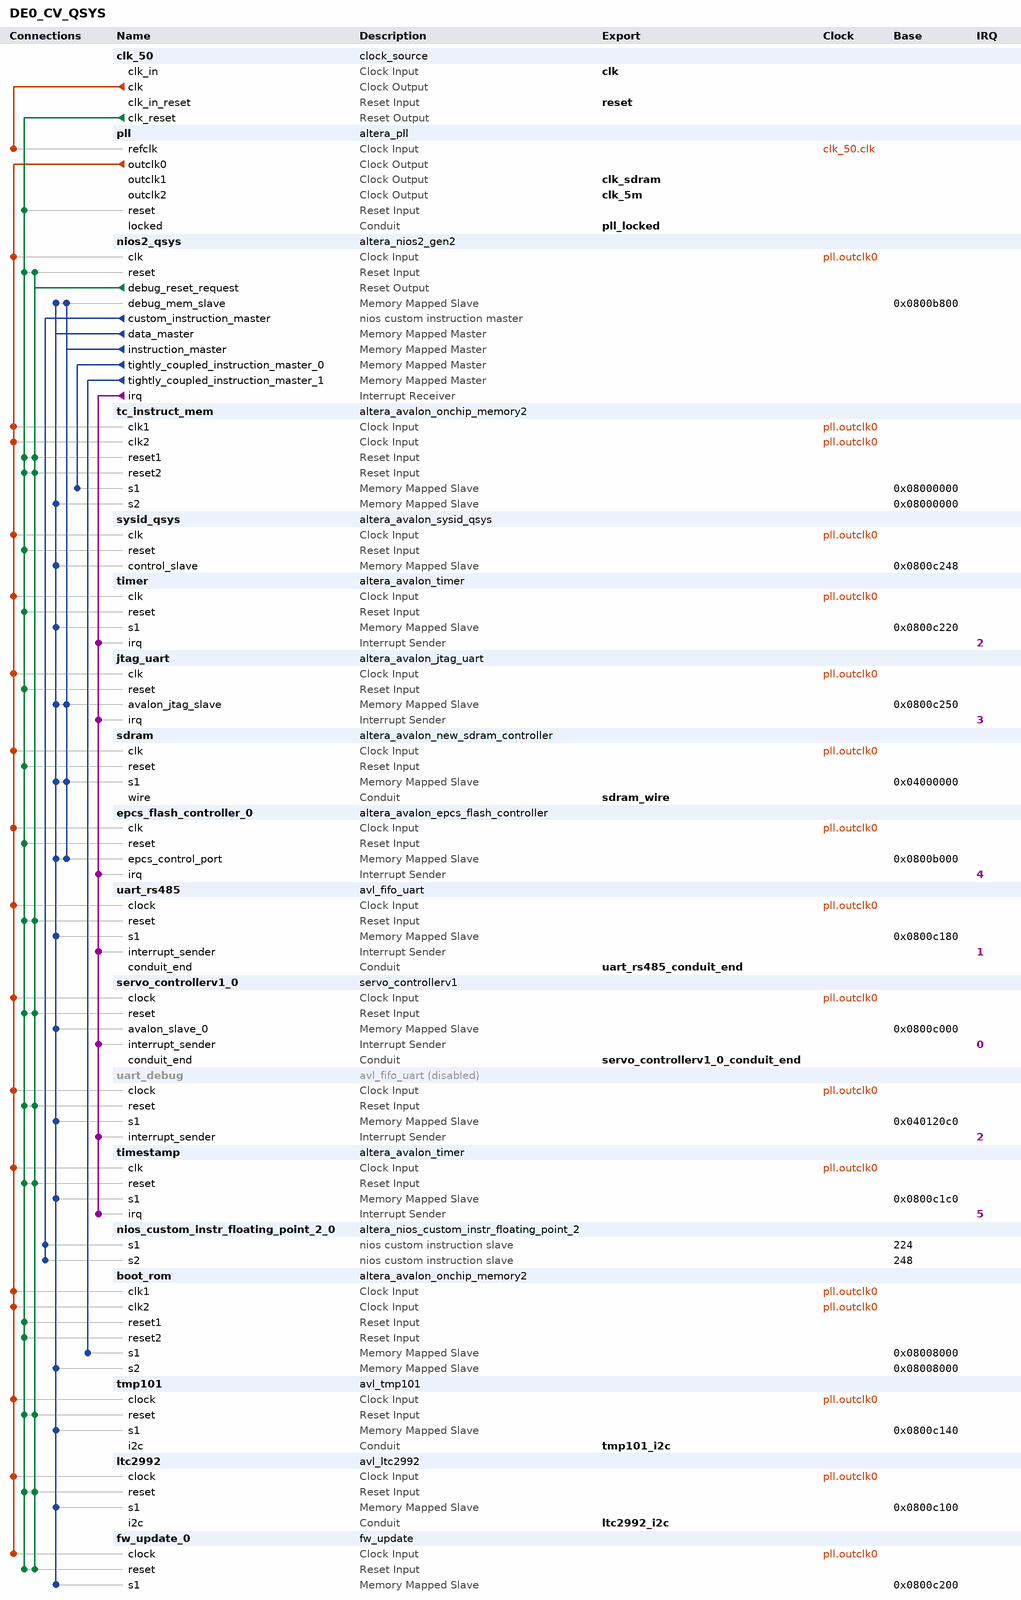
[diagram p0: system contents]
# Platform Designer (Qsys) system DE0_CV_QSYS, Cyclone V 5CEBA4F23C7
# Parameters at their usual value, and those the tool derives, are not listed.
package require -exact qsys 18.1
create_system DE0_CV_QSYS
set_project_property DEVICE_FAMILY {Cyclone V}
set_project_property DEVICE 5CEBA4F23C7

add_instance clk_50 clock_source 18.1
set_instance_parameter_value clk_50 clockFrequency 50000000

add_instance pll altera_pll 18.1
set_instance_parameter_value pll gui_device_speed_grade 2
set_instance_parameter_value pll gui_number_of_clocks 3
set_instance_parameter_value pll gui_operation_mode normal
set_instance_parameter_value pll gui_output_clock_frequency0 100.0
set_instance_parameter_value pll gui_output_clock_frequency1 100.0
set_instance_parameter_value pll gui_output_clock_frequency2 5.0
set_instance_parameter_value pll gui_phase_shift1 -3800
set_instance_parameter_value pll gui_phase_shift_deg1 -90.0
set_instance_parameter_value pll gui_pll_mode {Integer-N PLL}
set_instance_parameter_value pll gui_reference_clock_frequency 50.0
set_instance_parameter_value pll gui_use_locked true

add_instance nios2_qsys altera_nios2_gen2 18.1
set_instance_parameter_value nios2_qsys dcache_size 65536
set_instance_parameter_value nios2_qsys dividerType srt2
set_instance_parameter_value nios2_qsys exceptionSlave tc_instruct_mem.s1
set_instance_parameter_value nios2_qsys icache_numTCIM 2
set_instance_parameter_value nios2_qsys icache_size 65536
set_instance_parameter_value nios2_qsys impl Fast
set_instance_parameter_value nios2_qsys resetSlave boot_rom.s1
set_instance_parameter_value nios2_qsys setting_activateTrace true

add_instance tc_instruct_mem altera_avalon_onchip_memory2 18.1
set_instance_parameter_value tc_instruct_mem dataWidth 32
set_instance_parameter_value tc_instruct_mem dualPort true
set_instance_parameter_value tc_instruct_mem initMemContent true
set_instance_parameter_value tc_instruct_mem initializationFileName onchip_mem.hex
set_instance_parameter_value tc_instruct_mem memorySize 16536

add_instance sysid_qsys altera_avalon_sysid_qsys 18.1
set_instance_parameter_value sysid_qsys id 0

add_instance timer altera_avalon_timer 18.1
set_instance_parameter_value timer period 1
set_instance_parameter_value timer periodUnits MSEC

add_instance jtag_uart altera_avalon_jtag_uart 18.1
set_instance_parameter_value jtag_uart simInteractiveOptions NO_INTERACTIVE_WINDOWS

add_instance sdram altera_avalon_new_sdram_controller 18.1
set_instance_parameter_value sdram TAC 5.4
set_instance_parameter_value sdram TRCD 15.0
set_instance_parameter_value sdram TRP 15.0
set_instance_parameter_value sdram casLatency 3
set_instance_parameter_value sdram columnWidth 10
set_instance_parameter_value sdram dataWidth 16
set_instance_parameter_value sdram generateSimulationModel true
set_instance_parameter_value sdram model single_Micron_MT48LC4M32B2_7_chip
set_instance_parameter_value sdram numberOfBanks 4
set_instance_parameter_value sdram numberOfChipSelects 1
set_instance_parameter_value sdram powerUpDelay 100.0
set_instance_parameter_value sdram refreshPeriod 7.8125
set_instance_parameter_value sdram rowWidth 13

add_instance epcs_flash_controller_0 altera_avalon_epcs_flash_controller 18.1
set_instance_parameter_value epcs_flash_controller_0 resetrequest_enabled true

add_instance uart_rs485 avl_fifo_uart 1.0
set_instance_parameter_value uart_rs485 BAUDRATE 921600
set_instance_parameter_value uart_rs485 C_RX_THRESHOLD 32
set_instance_parameter_value uart_rs485 DATA_BIT 8
set_instance_parameter_value uart_rs485 FREQ_CLK 100000000
set_instance_parameter_value uart_rs485 OVERSAMPLING_RATE 4
set_instance_parameter_value uart_rs485 PARITY_BIT 0
set_instance_parameter_value uart_rs485 RX_FIFO_DEPTH 7
set_instance_parameter_value uart_rs485 RX_TIMEOUT_WORD 4
set_instance_parameter_value uart_rs485 STOP_BIT 0
set_instance_parameter_value uart_rs485 TX_FIFO_DEPTH 12

add_instance servo_controllerv1_0 servo_controllerv1 1.0
set_instance_parameter_value servo_controllerv1_0 C_MODE0 0
set_instance_parameter_value servo_controllerv1_0 C_MODE1 0
set_instance_parameter_value servo_controllerv1_0 C_MODE2 0
set_instance_parameter_value servo_controllerv1_0 C_MODE3 0
set_instance_parameter_value servo_controllerv1_0 FREQ_CLK 100000000
set_instance_parameter_value servo_controllerv1_0 PWM_BASE_FREQ 10000000
set_instance_parameter_value servo_controllerv1_0 PWM_FREQ 1000
set_instance_parameter_value servo_controllerv1_0 SPI_SPEED 1000000

add_instance uart_debug avl_fifo_uart 1.0
set_instance_property uart_debug ENABLED false
set_instance_parameter_value uart_debug BAUDRATE 921600
set_instance_parameter_value uart_debug C_RX_THRESHOLD 32
set_instance_parameter_value uart_debug DATA_BIT 8
set_instance_parameter_value uart_debug FREQ_CLK 100000000
set_instance_parameter_value uart_debug OVERSAMPLING_RATE 4
set_instance_parameter_value uart_debug PARITY_BIT 0
set_instance_parameter_value uart_debug RX_FIFO_DEPTH 4
set_instance_parameter_value uart_debug RX_TIMEOUT_WORD 4
set_instance_parameter_value uart_debug STOP_BIT 0
set_instance_parameter_value uart_debug TX_FIFO_DEPTH 11

add_instance timestamp altera_avalon_timer 18.1
set_instance_parameter_value timestamp counterSize 64
set_instance_parameter_value timestamp period 1000
set_instance_parameter_value timestamp periodUnits CLOCKS

add_instance nios_custom_instr_floating_point_2_0 altera_nios_custom_instr_floating_point_2 18.1
set_instance_parameter_value nios_custom_instr_floating_point_2_0 arithmetic_present true
set_instance_parameter_value nios_custom_instr_floating_point_2_0 comparison_present true
set_instance_parameter_value nios_custom_instr_floating_point_2_0 conversion_present true
set_instance_parameter_value nios_custom_instr_floating_point_2_0 root_present true

add_instance boot_rom altera_avalon_onchip_memory2 18.1
set_instance_parameter_value boot_rom dataWidth 32
set_instance_parameter_value boot_rom dualPort true
set_instance_parameter_value boot_rom initMemContent true
set_instance_parameter_value boot_rom initializationFileName onchip_mem.hex
set_instance_parameter_value boot_rom memorySize 8192

add_instance tmp101 avl_tmp101 1.0
set_instance_parameter_value tmp101 BUS_CLK 100000
set_instance_parameter_value tmp101 FREQ_CLK 100000000
set_instance_parameter_value tmp101 I2C_ADDR 0
set_instance_parameter_value tmp101 UPDATE_FREQ 2

add_instance ltc2992 avl_ltc2992 1.0
set_instance_parameter_value ltc2992 BUS_CLK 10000
set_instance_parameter_value ltc2992 FREQ_CLK 100000000

add_instance fw_update_0 fw_update 1.0
set_instance_parameter_value fw_update_0 LOCK_PWD 1234532
set_instance_parameter_value fw_update_0 PRODUCT_ID 0
set_instance_parameter_value fw_update_0 VERSION_MAJOR 1
set_instance_parameter_value fw_update_0 VERSION_MINOR 4

# connections
add_connection clk_50.clk pll.refclk clock
add_connection pll.outclk0 boot_rom.clk1 clock
add_connection pll.outclk0 boot_rom.clk2 clock
add_connection pll.outclk0 epcs_flash_controller_0.clk clock
add_connection pll.outclk0 fw_update_0.clock clock
add_connection pll.outclk0 jtag_uart.clk clock
add_connection pll.outclk0 ltc2992.clock clock
add_connection pll.outclk0 nios2_qsys.clk clock
add_connection pll.outclk0 sdram.clk clock
add_connection pll.outclk0 servo_controllerv1_0.clock clock
add_connection pll.outclk0 sysid_qsys.clk clock
add_connection pll.outclk0 tc_instruct_mem.clk1 clock
add_connection pll.outclk0 tc_instruct_mem.clk2 clock
add_connection pll.outclk0 timer.clk clock
add_connection pll.outclk0 timestamp.clk clock
add_connection pll.outclk0 tmp101.clock clock
add_connection pll.outclk0 uart_debug.clock clock
add_connection pll.outclk0 uart_rs485.clock clock
add_connection clk_50.clk_reset boot_rom.reset1 reset
add_connection clk_50.clk_reset boot_rom.reset2 reset
add_connection clk_50.clk_reset epcs_flash_controller_0.reset reset
add_connection clk_50.clk_reset fw_update_0.reset reset
add_connection clk_50.clk_reset jtag_uart.reset reset
add_connection clk_50.clk_reset ltc2992.reset reset
add_connection clk_50.clk_reset nios2_qsys.reset reset
add_connection clk_50.clk_reset pll.reset reset
add_connection clk_50.clk_reset sdram.reset reset
add_connection clk_50.clk_reset servo_controllerv1_0.reset reset
add_connection clk_50.clk_reset sysid_qsys.reset reset
add_connection clk_50.clk_reset tc_instruct_mem.reset1 reset
add_connection clk_50.clk_reset tc_instruct_mem.reset2 reset
add_connection clk_50.clk_reset timer.reset reset
add_connection clk_50.clk_reset timestamp.reset reset
add_connection clk_50.clk_reset tmp101.reset reset
add_connection clk_50.clk_reset uart_debug.reset reset
add_connection clk_50.clk_reset uart_rs485.reset reset
add_connection nios2_qsys.debug_reset_request fw_update_0.reset reset
add_connection nios2_qsys.debug_reset_request ltc2992.reset reset
add_connection nios2_qsys.debug_reset_request nios2_qsys.reset reset
add_connection nios2_qsys.debug_reset_request servo_controllerv1_0.reset reset
add_connection nios2_qsys.debug_reset_request tc_instruct_mem.reset1 reset
add_connection nios2_qsys.debug_reset_request tc_instruct_mem.reset2 reset
add_connection nios2_qsys.debug_reset_request timestamp.reset reset
add_connection nios2_qsys.debug_reset_request tmp101.reset reset
add_connection nios2_qsys.debug_reset_request uart_debug.reset reset
add_connection nios2_qsys.debug_reset_request uart_rs485.reset reset
add_connection nios2_qsys.data_master boot_rom.s2 avalon
set_connection_parameter_value nios2_qsys.data_master/boot_rom.s2 baseAddress 0x08008000
add_connection nios2_qsys.data_master epcs_flash_controller_0.epcs_control_port avalon
set_connection_parameter_value nios2_qsys.data_master/epcs_flash_controller_0.epcs_control_port baseAddress 0x0800b000
add_connection nios2_qsys.data_master fw_update_0.s1 avalon
set_connection_parameter_value nios2_qsys.data_master/fw_update_0.s1 baseAddress 0x0800c200
add_connection nios2_qsys.data_master jtag_uart.avalon_jtag_slave avalon
set_connection_parameter_value nios2_qsys.data_master/jtag_uart.avalon_jtag_slave baseAddress 0x0800c250
add_connection nios2_qsys.data_master ltc2992.s1 avalon
set_connection_parameter_value nios2_qsys.data_master/ltc2992.s1 baseAddress 0x0800c100
add_connection nios2_qsys.data_master nios2_qsys.debug_mem_slave avalon
set_connection_parameter_value nios2_qsys.data_master/nios2_qsys.debug_mem_slave baseAddress 0x0800b800
add_connection nios2_qsys.data_master sdram.s1 avalon
set_connection_parameter_value nios2_qsys.data_master/sdram.s1 baseAddress 0x04000000
add_connection nios2_qsys.data_master servo_controllerv1_0.avalon_slave_0 avalon
set_connection_parameter_value nios2_qsys.data_master/servo_controllerv1_0.avalon_slave_0 baseAddress 0x0800c000
add_connection nios2_qsys.data_master sysid_qsys.control_slave avalon
set_connection_parameter_value nios2_qsys.data_master/sysid_qsys.control_slave baseAddress 0x0800c248
add_connection nios2_qsys.data_master tc_instruct_mem.s2 avalon
set_connection_parameter_value nios2_qsys.data_master/tc_instruct_mem.s2 baseAddress 0x08000000
add_connection nios2_qsys.data_master timer.s1 avalon
set_connection_parameter_value nios2_qsys.data_master/timer.s1 baseAddress 0x0800c220
add_connection nios2_qsys.data_master timestamp.s1 avalon
set_connection_parameter_value nios2_qsys.data_master/timestamp.s1 baseAddress 0x0800c1c0
add_connection nios2_qsys.data_master tmp101.s1 avalon
set_connection_parameter_value nios2_qsys.data_master/tmp101.s1 baseAddress 0x0800c140
add_connection nios2_qsys.data_master uart_debug.s1 avalon
set_connection_parameter_value nios2_qsys.data_master/uart_debug.s1 baseAddress 0x040120c0
add_connection nios2_qsys.data_master uart_rs485.s1 avalon
set_connection_parameter_value nios2_qsys.data_master/uart_rs485.s1 baseAddress 0x0800c180
add_connection nios2_qsys.instruction_master epcs_flash_controller_0.epcs_control_port avalon
set_connection_parameter_value nios2_qsys.instruction_master/epcs_flash_controller_0.epcs_control_port baseAddress 0x0800b000
add_connection nios2_qsys.instruction_master jtag_uart.avalon_jtag_slave avalon
set_connection_parameter_value nios2_qsys.instruction_master/jtag_uart.avalon_jtag_slave baseAddress 0x0800c250
add_connection nios2_qsys.instruction_master nios2_qsys.debug_mem_slave avalon
set_connection_parameter_value nios2_qsys.instruction_master/nios2_qsys.debug_mem_slave baseAddress 0x0800b800
add_connection nios2_qsys.instruction_master sdram.s1 avalon
set_connection_parameter_value nios2_qsys.instruction_master/sdram.s1 baseAddress 0x04000000
add_connection nios2_qsys.tightly_coupled_instruction_master_0 tc_instruct_mem.s1 avalon
set_connection_parameter_value nios2_qsys.tightly_coupled_instruction_master_0/tc_instruct_mem.s1 baseAddress 0x08000000
add_connection nios2_qsys.tightly_coupled_instruction_master_1 boot_rom.s1 avalon
set_connection_parameter_value nios2_qsys.tightly_coupled_instruction_master_1/boot_rom.s1 baseAddress 0x08008000
add_connection nios2_qsys.irq epcs_flash_controller_0.irq interrupt
set_connection_parameter_value nios2_qsys.irq/epcs_flash_controller_0.irq irqNumber 4
add_connection nios2_qsys.irq jtag_uart.irq interrupt
set_connection_parameter_value nios2_qsys.irq/jtag_uart.irq irqNumber 3
add_connection nios2_qsys.irq servo_controllerv1_0.interrupt_sender interrupt
set_connection_parameter_value nios2_qsys.irq/servo_controllerv1_0.interrupt_sender irqNumber 0
add_connection nios2_qsys.irq timer.irq interrupt
set_connection_parameter_value nios2_qsys.irq/timer.irq irqNumber 2
add_connection nios2_qsys.irq timestamp.irq interrupt
set_connection_parameter_value nios2_qsys.irq/timestamp.irq irqNumber 5
add_connection nios2_qsys.irq uart_debug.interrupt_sender interrupt
set_connection_parameter_value nios2_qsys.irq/uart_debug.interrupt_sender irqNumber 2
add_connection nios2_qsys.irq uart_rs485.interrupt_sender interrupt
set_connection_parameter_value nios2_qsys.irq/uart_rs485.interrupt_sender irqNumber 1
add_connection nios2_qsys.custom_instruction_master nios_custom_instr_floating_point_2_0.s1 nios_custom_instruction
set_connection_parameter_value nios2_qsys.custom_instruction_master/nios_custom_instr_floating_point_2_0.s1 CIName nios_custom_instr_floating_point_2_0
set_connection_parameter_value nios2_qsys.custom_instruction_master/nios_custom_instr_floating_point_2_0.s1 baseAddress 224
add_connection nios2_qsys.custom_instruction_master nios_custom_instr_floating_point_2_0.s2 nios_custom_instruction
set_connection_parameter_value nios2_qsys.custom_instruction_master/nios_custom_instr_floating_point_2_0.s2 CIName nios_custom_instr_floating_point_2_0_1
set_connection_parameter_value nios2_qsys.custom_instruction_master/nios_custom_instr_floating_point_2_0.s2 baseAddress 248

# exported interfaces
add_interface clk clock sink
set_interface_property clk EXPORT_OF clk_50.clk_in
add_interface clk_5m clock source
set_interface_property clk_5m EXPORT_OF pll.outclk2
add_interface clk_sdram clock source
set_interface_property clk_sdram EXPORT_OF pll.outclk1
add_interface ltc2992_i2c conduit end
set_interface_property ltc2992_i2c EXPORT_OF ltc2992.i2c
add_interface pll_locked conduit end
set_interface_property pll_locked EXPORT_OF pll.locked
add_interface reset reset sink
set_interface_property reset EXPORT_OF clk_50.clk_in_reset
add_interface sdram_wire conduit end
set_interface_property sdram_wire EXPORT_OF sdram.wire
add_interface servo_controllerv1_0_conduit_end conduit end
set_interface_property servo_controllerv1_0_conduit_end EXPORT_OF servo_controllerv1_0.conduit_end
add_interface tmp101_i2c conduit end
set_interface_property tmp101_i2c EXPORT_OF tmp101.i2c
add_interface uart_rs485_conduit_end conduit end
set_interface_property uart_rs485_conduit_end EXPORT_OF uart_rs485.conduit_end

set_interconnect_requirement {$system} qsys_mm.clockCrossingAdapter HANDSHAKE
set_interconnect_requirement {$system} qsys_mm.maxAdditionalLatency 1

save_system DE0_CV_QSYS.qsys
